# EAGLE schematic ATSAMD11C14A (EAGLE 9.3.1)
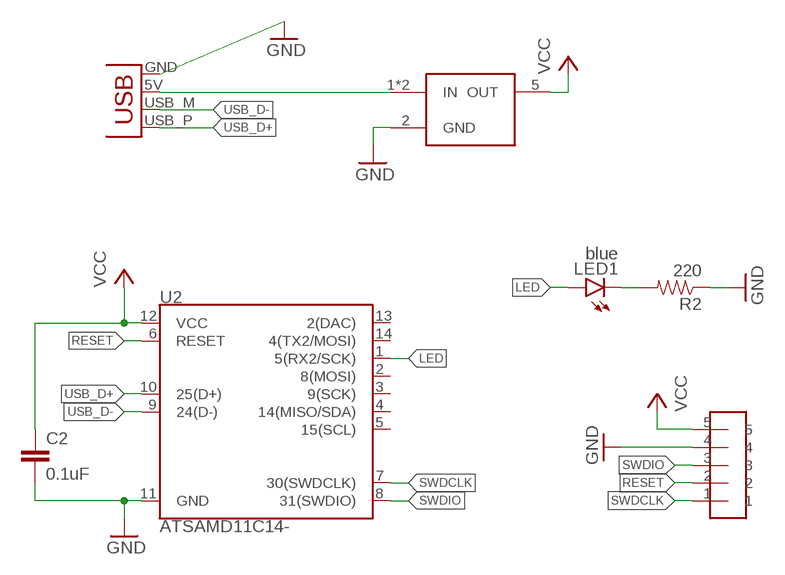
[diagram p0: schematic, sheet 1]

## Parts
C2  0.1uF  CAP0603-CAP  [0603-CAP]
LED1  blue  LED0603  [LED-0603]
R2  220  RESISTOR0603  [0603-RES]
U2  ATSAMD11C14-  [SOIC14]
U$1  HEADER-5-TESTPOINT  [TESTPOINT-5]
U$2  USB_CONN_UNSHIELDED  [USB-A-PCB]
U$3  REGULATOR3.3V-0.5A-MIC5219  [SOT23-5]

## Nets
5V: U$2.5V(VBUS) U$3.1(IN) U$3.3(IN)
GND: C2.2 R2.1 U2.11(GND) U$1.4 U$2.GND U$3.2(GND)
LED: LED1.A U2.1(5(RX2/SCK))
N$2: LED1.C R2.2
RESET: U2.6(RESET) U$1.2
SWDCLK: U2.7(30(SWDCLK)) U$1.1
SWDIO: U2.8(31(SWDIO)) U$1.3
USB_D+: U2.10(25(D+)) U$2.USB_P(D+)
USB_D-: U2.9(24(D-)) U$2.USB_M(D-)
VCC: C2.1 U2.12(VCC) U$1.5 U$3.5(OUT)
Unconnected: U2.2(8(MOSI)) U2.3(9(SCK)) U2.4(14(MISO/SDA)) U2.5(15(SCL)) U2.13(2(DAC)) U2.14(4(TX2/MOSI))

## Library data of the parts
C2 = homemade-hardware:CAP: Capacitor Standard 0603 ceramic capacitor, and 0.1" leaded capacitor.
LED1 = homemade-hardware:LED: LEDs Standard schematic elements and footprints for 5mm, 3mm, 1206, and 0603 sized LEDs. 5mm - Spark Fun Electronics SKU : COM-00529 (and others)
R2 = homemade-hardware:RESISTOR: Resistor Basic schematic elements and footprints for 0603, 1206, and PTH resistors.
U2 = homemade-hardware:ATSAMD11C14: ATSAMD11C14A <https://www.digikey.com/product-detail/en/microchip-technology/ATSAMD11C14A-SSNT/ATSAMD11C14A-SSNTCT-ND/5956608>: Native USB M0 (arduino core <https://github.com/mattairtech/ArduinoCore-samd>)
U$1 = homemade-hardware:HEADER-5
U$2 = homemade-hardware:USB_CONN_UNSHIELDED
U$3 = homemade-hardware:REGULATOR: MC7805CTG <https://www.digikey.com/product-detail/en/on-semiconductor/MC7805CTG/MC7805CTGOS-ND/919333>: 5V/1A DIP Linear Regulator UA78M33CDCYR <https://www.digikey.com/product-detail/en/texas-instruments/UA78M33CDCYR/296-13424-1-ND/484495>: 3.3V/0.5A SMD Linear Regulator MIC5219-5.0YM5-TR <https://www.digikey.com/products/en/integrated-circuits-ics/pmic-voltage-regulators-linear/699?k=MIC5219-5.0YM5-TR&k=&pkeyword=MIC5219-5.0YM5-TR&sv=0&pv7=2&sf=0&quantity=&ColumnSort=0&page=1&pageSize=25>: 5V/0.5A SMD Linear Regulator MIC5219-3.3YM5-TR <https://www.digikey.com/products/en/integrated-circuits-ics/pmic-voltage-regulators-linear/699?k=MIC5219-3.3YM5-TR&k=&pkeyword=MIC5219-3.3YM5-TR&sv=0&pv7=2&sf=0&quantity=&ColumnSort=0&page=1&pageSize=25>: 3.3V/0.5A SMD Linear Regulator